# EAGLE design JasminUSBASP (EAGLE 7.1.0)
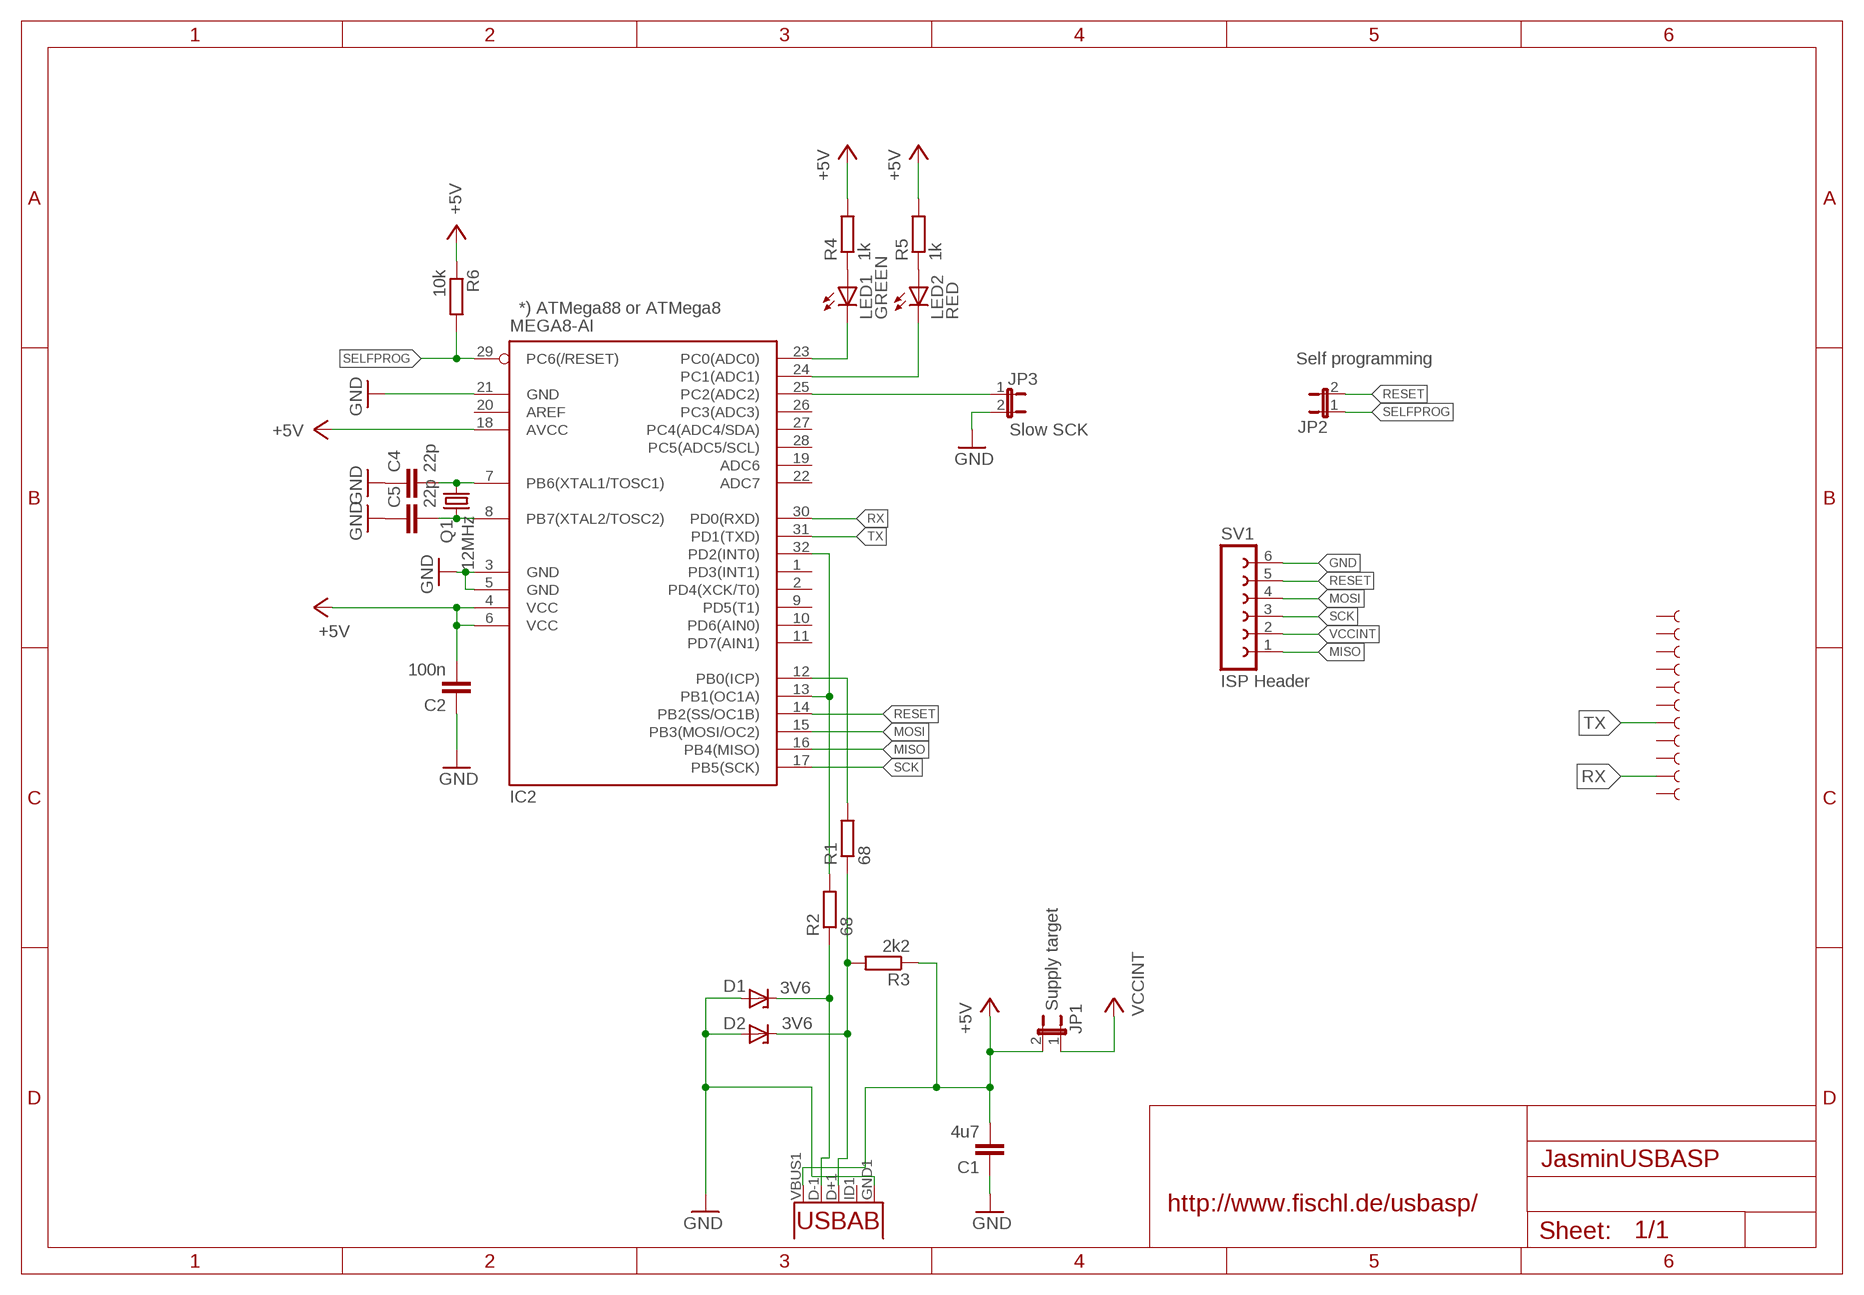
[diagram p0: schematic, sheet 1]

## Parts
A2/16  SEWTAP9  [PETAL-LONG-1-2SIDE]
A3/17  SEWTAP9  [PETAL-LONG-1-2SIDE]
A4/18  SEWTAP9  [PETAL-LONG-1-2SIDE]
A5/19  SEWTAP9  [PETAL-LONG-1-2SIDE]
C1  4u7  C-EUC1206  [C1206]
C2  100n  C-EUC1206  [C1206]
C4  22p  C-EUC1206  [C1206]
C5  22p  C-EUC1206  [C1206]
D1  3V6  ZENER-DIODEDO34-7  [DO34Z7]
D2  3V6  ZENER-DIODEDO34-7  [DO34Z7]
IC2  MEGA8-AI  [TQFP32-08]
JP1  Supply target  JP1E  [JP1]
JP2  Self programming  JP1E  [JP1]
JP3  Slow SCK  JP1E  [JP1]
JP9  Micro USB  USB-ABCONN-11794  [USB-AB-MICRO-SMD_V03]
LED1  GREEN  LEDCHIPLED_1206  [CHIPLED_1206]
LED2  RED  LEDCHIPLED_1206  [CHIPLED_1206]
Q1  12MHz  CRYTALHC49S  [HC49/S]
R1  68  R-EU_R1206  [R1206]
R2  68  R-EU_R1206  [R1206]
R3  2k2  R-EU_R1206  [R1206]
R4  1k  R-EU_R1206  [R1206]
R5  1k  R-EU_R1206  [R1206]
R6  10k  R-EU_R1206  [R1206]
SV1  ISP Header  FE06W  [FE06W]
U$4  SEWTAP9  [PETAL-LONG-1-2SIDE]
U$35  SEWTAP9  [PETAL-LONG-1-2SIDE]
U$37  SEWTAP9  [PETAL-LONG-1-2SIDE]
U$39  SEWTAP9  [PETAL-LONG-1-2SIDE]
U$41  SEWTAP9  [PETAL-LONG-1-2SIDE]
U$43  SEWTAP9  [PETAL-LONG-1-2SIDE]
U$45  SEWTAP9  [PETAL-LONG-1-2SIDE]

## Nets
+5V: C1.2 C2.2 IC2.4(VCC) IC2.6(VCC) IC2.18(AVCC) JP1.2 JP9.VBUS1(VBUS) R3.1 R4.2 R5.2 R6.1
GND: C1.1 C2.1 C4.1 C5.1 D1.A D2.A IC2.3(GND) IC2.5(GND) IC2.21(GND) JP3.2 JP9.GND1(GND) SV1.6
MISO: IC2.16(PB4(MISO)) SV1.1
MOSI: IC2.15(PB3(MOSI/OC2)) SV1.4
N$1: LED1.A R4.1
N$3: LED2.A R5.1
N$5: D2.C JP9.D+1(D+) R1.1 R3.2
N$7: IC2.13(PB1(OC1A)) IC2.32(PD2(INT0)) R2.2
N$8: D1.C JP9.D-1(D-) R2.1
N$12: IC2.25(PC2(ADC2)) JP3.1
N$14: IC2.23(PC0(ADC0)) LED1.C
N$15: IC2.24(PC1(ADC1)) LED2.C
N$16: IC2.12(PB0(ICP)) R1.2
N$22: C4.2 IC2.7(PB6(XTAL1/TOSC1)) Q1.2
N$23: C5.2 IC2.8(PB7(XTAL2/TOSC2)) Q1.1
RESET: IC2.14(PB2(SS/OC1B)) JP2.2 SV1.5
RX: IC2.30(PD0(RXD)) U$39.1
SCK: IC2.17(PB5(SCK)) SV1.3
SELFPROG: IC2.29(PC6(/RESET)) JP2.1 R6.2
TX: IC2.31(PD1(TXD)) U$41.1
VCCINT: JP1.1 SV1.2
Unconnected: A2/16.1 A3/17.1 A4/18.1 A5/19.1 IC2.1(PD3(INT1)) IC2.2(PD4(XCK/T0)) IC2.9(PD5(T1)) IC2.10(PD6(AIN0)) IC2.11(PD7(AIN1)) IC2.19(ADC6) IC2.20(AREF) IC2.22(ADC7) IC2.26(PC3(ADC3)) IC2.27(PC4(ADC4/SDA)) IC2.28(PC5(ADC5/SCL)) JP9.ID1(USBID) U$4.1 U$35.1 U$37.1 U$43.1 U$45.1

## Notes on the sheet
- *) ATMega88 or ATMega8
- http://www.fischl.de/usbasp/

## Library data of the parts
A2/16 A3/17 A4/18 A5/19 U$4 U$35 U$37 U$39 U$41 U$43 U$45 = LilyPad-Wearables:SEWTAP
C1 C2 C4 C5 = rcl:C-EU: CAPACITOR, European symbol
D1 D2 = diode:ZENER-DIODE: Z-Diode
IC2 = atmel:MEGA8: MICROCONTROLLER 8 Kbytes FLASH, 1 kbytes SRAM, 512 bytes EEPROM, USART, 6-channel 10 bit ADC, 2-channel 8 bit ADC Pin compatible with Atmega48, ATMega88, ATMega168 Source: avr.lbr; MPN: ATMEGA8-16AU; OC_FARNELL: 9171371; OC_NEWARK: 73M8863
JP1-JP3 = jumper:JP1E: JUMPER
JP9 = SparkFun-Connectors:USB-AB: This is a USB AB connector that is compatible with USB OTG. i.e. this connector can serve as a host or device; PROD_ID: CONN-11794
LED1 LED2 = led:LED: LED OSRAM: - CHIPLED LG R971, LG N971, LY N971, LG Q971, LY Q971, LO R971, LY R971 LH N974, LH R974 LS Q976, LO Q976, LY Q976 LO Q996 - Hyper CHIPLED LW Q18S LB Q993, LB Q99A, LB R99A - SideLED LS A670, LO A670, LY A670, LG A670, LP A670 LB A673, LV A673, LT A673, LW A673 LH A674 LY A675 LS A676, LA A676, LO A676, LY A676, LW A676 LS A679, LY A679, LG A679 - Hyper Micro SIDELED® LS Y876, LA Y876, LO Y876, LY Y876 LT Y87S - SmartLED LW L88C, LW L88S LB L89C, LB L89S, LG L890 LS L89K, LO L89K, LY L89K LS L896, LA L896, LO L896, LY L896 - TOPLED LS T670, LO T670, LY T670, LG T670, LP T670 LSG T670, LSP T670, LSY T670, LOP T670, LYG T670 LG T671, LOG T671, LSG T671 LB T673, LV T673, LT T673, LW T673 LH T674 LS T676, LA T676, LO T676, LY T676, LB T676, LH T676, LSB T676, LW T676 LB T67C, LV T67C, LT T67C, LS T67K, LO T67K, LY T67K, LW E67C LS E67B, LA E67B, LO E67B, LY E67B, LB E67C, LV E67C, LT E67C LW T67C LS T679, LY T679, LG T679 LS T770, LO T770, LY T770, LG T770, LP T770 LB T773, LV T773, LT T773, LW T773 LH T774 LS E675, LA E675, LY E675, LS T675 LS T776, LA T776, LO T776, LY T776, LB T776 LHGB T686 LT T68C, LB T68C - Hyper Mini TOPLED® LB M676 - Mini TOPLED Santana® LG M470 LS M47K, LO M47K, LY M47K Source: http://www.osram.convergy.de LUXEON: - LUMILED® LXK2-PW12-R00, LXK2-PW12-S00, LXK2-PW14-U00, LXK2-PW14-V00 LXK2-PM12-R00, LXK2-PM12-S00, LXK2-PM14-U00 LXK2-PE12-Q00, LXK2-PE12-R00, LXK2-PE12-S00, LXK2-PE14-T00, LXK2-PE14-U00 LXK2-PB12-K00, LXK2-PB12-L00, LXK2-PB12-M00, LXK2-PB14-N00, LXK2-PB14-P00, LXK2-PB14-Q00 LXK2-PR12-L00, LXK2-PR12-M00, LXK2-PR14-Q00, LXK2-PR14-R00 LXK2-PD12-Q00, LXK2-PD12-R00, LXK2-PD12-S00 LXK2-PH12-R00, LXK2-PH12-S00 LXK2-PL12-P00, LXK2-PL12-Q00, LXK2-PL12-R00 Source: www.luxeon.com KINGBRIGHT: KA-3528ASYC Source: www.kingbright.com
Q1 = crystal:CRYTAL: CRYSTAL
R1-R6 = rcl:R-EU_: RESISTOR, European symbol
SV1 = con-lsta:FE06W: FEMALE HEADER; OC_FARNELL: unknown; OC_NEWARK: unknown

## Net classes
1 VCC: width 0.254 mm

## Board
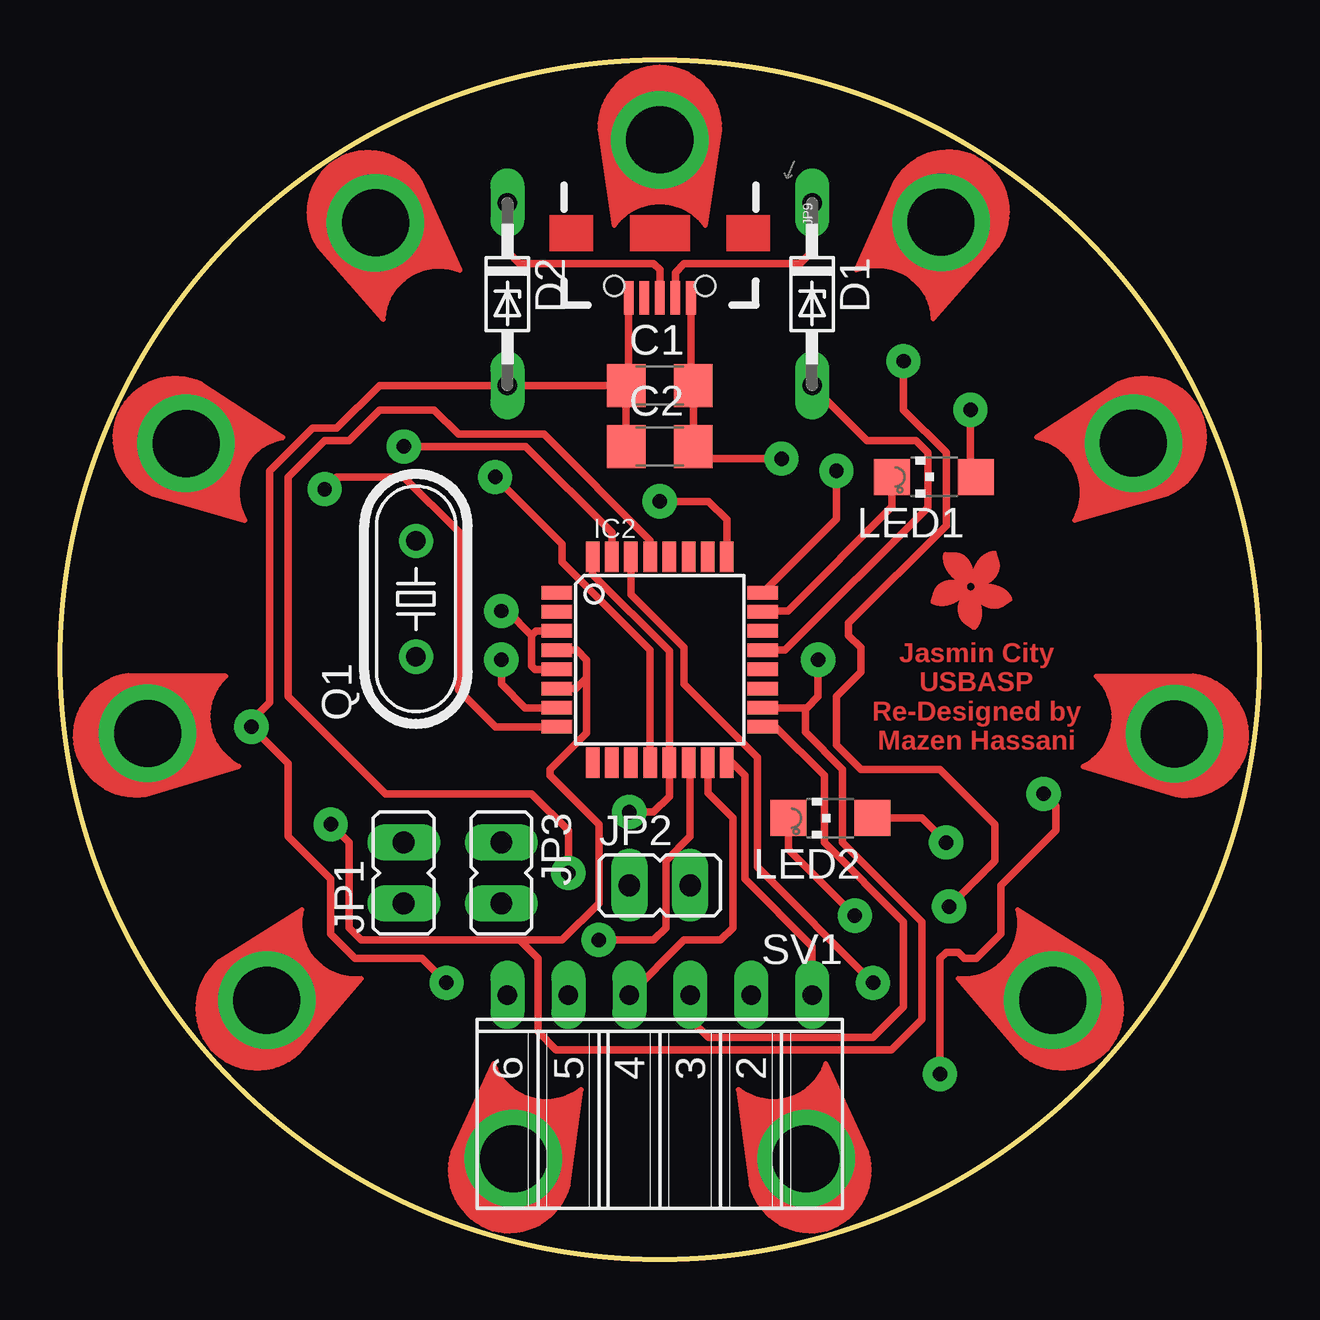
[diagram p1: board, top side]
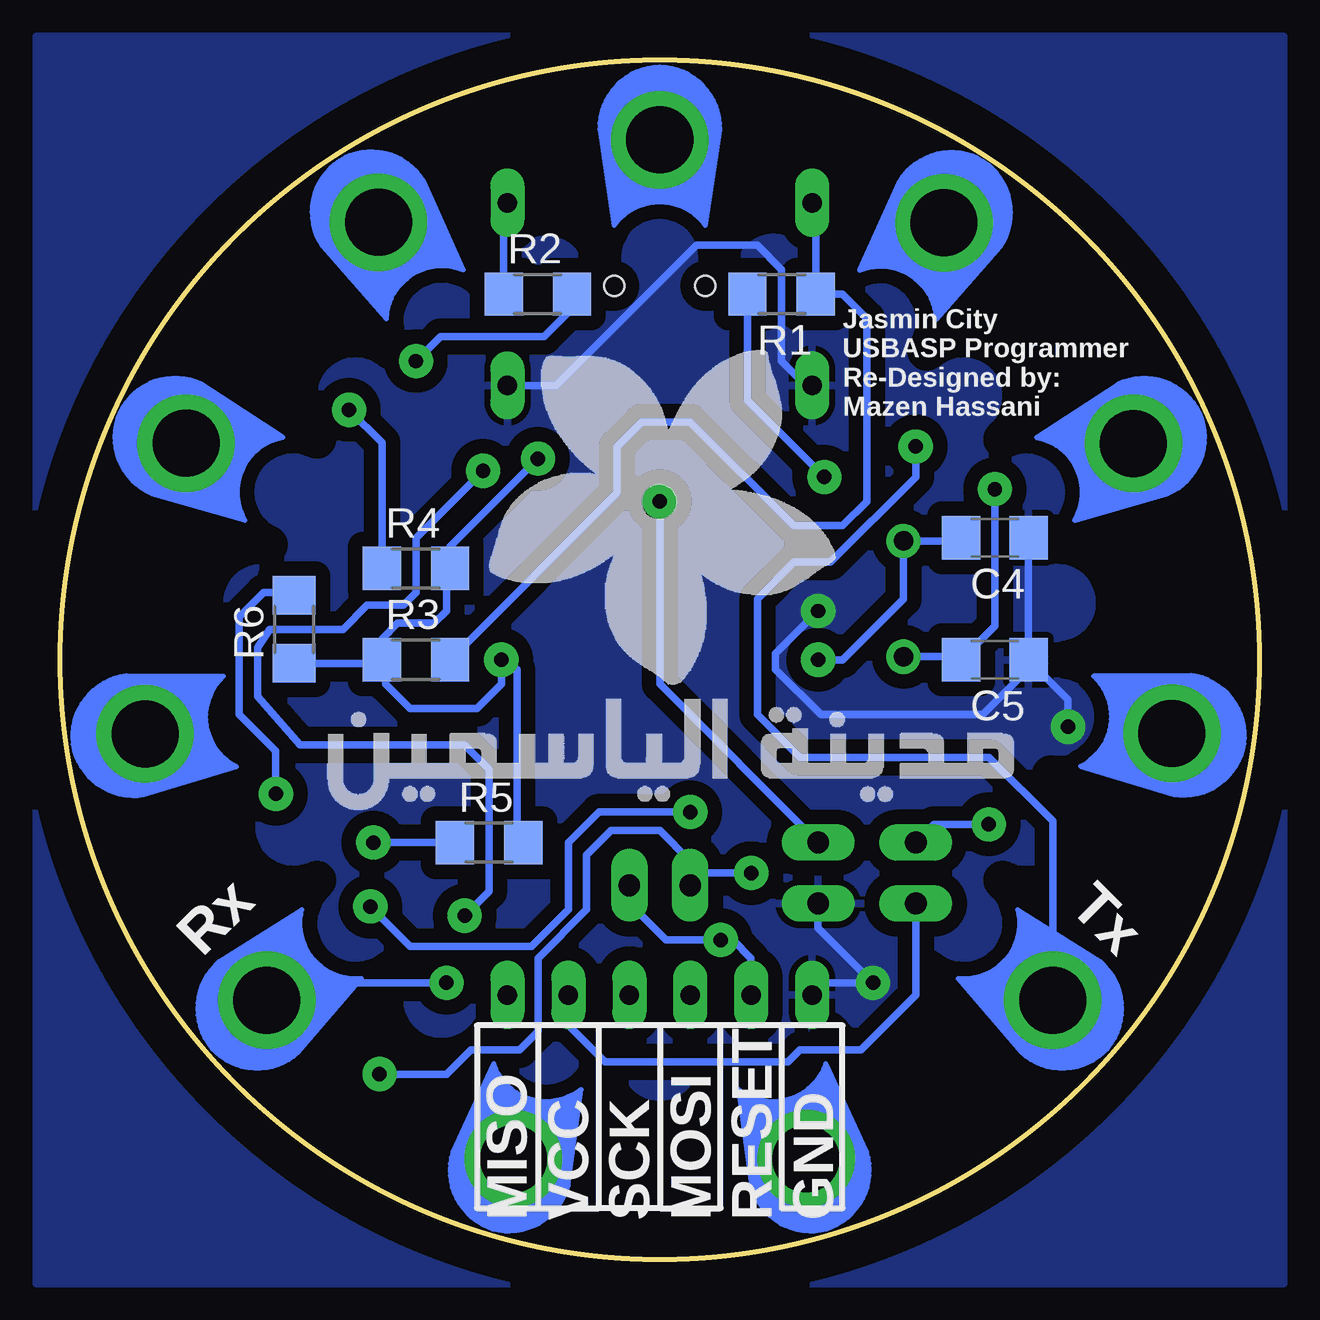
[diagram p2: board, bottom side, seen from below]

Size 50 x 50 mm. Coordinates in mm from the lower left corner, seen from the top.
Outline: circle at 25,25 radius 25
Copper layers (1*16): Top 0.035mm / dielectric 1.5mm / Bottom 0.035mm
Design rules "SparkFun": minimum track width 8mil, minimum drill 20mil, track to track 8mil, track to pad 8mil, pad to pad 8mil, via to via 8mil, smd to smd 8mil, copper to edge 8mil, drill to drill 8mil, minimum pad ring 12mil, minimum via ring 10mil, stop-mask expansion 4mil, vias tented up to drill 20mil, thermal gap 10mil
bRestrict: area 2.4,2.4 to 47.6,47.6; area 21,42.8 to 23.5,44; area 31.6,41.3 to 34.4,43; area 36.3,38.4 to 38.9,40.7; area 40,34.1 to 42,36.9; area 42.2,29.2 to 43.6,31.8; area 42.8,23.9 to 44,26.2; area 42.2,18.2 to 43.7,20.9; area 36.3,9.4 to 39,11.7; area 31.7,7 to 34.5,8.7; area 26.5,6 to 28.9,7.3; area 21.1,6 to 23.6,7.3; area 15.6,7 to 18.3,8.7; area 11,9.3 to 13.8,11.6; area 8,13.1 to 10.1,15.9; area 6.4,18.2 to 8,20.8; area 6,23.7 to 7.2,26.2; area 6.3,29.1 to 7.9,31.7; area 8,34 to 10.1,36.9; area 11,38.3 to 13.7,40.6; area 15.4,41.2 to 18.4,43; area 26.4,42.5 to 29.1,44; area 40,13 to 42,16.1; 22 lines

### Footprints (pad centres in the part's own frame; a part is rotated, then mirrored left to right if it is on the bottom)
PETAL-LONG-1-2SIDE = drill 2.794 pad 4.064: 1 0.03,0
C1206 = smd 1.6 x 1.8: 1 -1.4,0; 2 1.4,0
DO34Z7 = drill 0.813 long: A 3.81,0; C -3.81,0
TQFP32-08 = smd 1.27 x 0.559: 1 -4.293,2.8; 2 -4.293,2; 3 -4.293,1.2; 4 -4.293,0.4; 5 -4.293,-0.4; 6 -4.293,-1.2; 7 -4.293,-2; 8 -4.293,-2.8; 17 4.293,-2.8; 18 4.293,-2; 19 4.293,-1.2; 20 4.293,-0.4; 21 4.293,0.4; 22 4.293,1.2; 23 4.293,2; 24 4.293,2.8 | smd 0.559 x 1.27: 9 -2.8,-4.293; 10 -2,-4.293; 11 -1.2,-4.293; 12 -0.4,-4.293; 13 0.4,-4.293; 14 1.2,-4.293; 15 2,-4.293; 16 2.8,-4.293; 25 2.8,4.293; 26 2,4.293; 27 1.2,4.293; 28 0.4,4.293; 29 -0.4,4.293; 30 -1.2,4.293; 31 -2,4.293; 32 -2.8,4.293
JP1 = drill 0.914 long: 1 0,-1.27; 2 0,1.27
USB-AB-MICRO-SMD_V03 = smd 1.4 x 0.4: D+1 2.7,0; D-1 2.7,0.65; GND1 2.7,-1.3; ID1 2.7,-0.65; VBUS1 2.7,1.3 | hole 0.85: 2.2,1.9; 2.2,-1.9
CHIPLED_1206 = smd 1.5 x 1.5: A 0,-1.75; C 0,1.75
HC49/S = drill 0.813: 1 -2.413,0; 2 2.413,0
R1206 = smd 1.6 x 1.803: 1 -1.422,0; 2 1.422,0
FE06W = drill 0.813 long: 1 -6.35,0; 2 -3.81,0; 3 -1.27,0; 4 1.27,0; 5 3.81,0; 6 6.35,0

### Placement (x,y rotation side)
A2/16  44.77,34.04 204.5 top
A3/17  36.74,43.26 237.3 top
A4/18  25,46.7 270 top
A5/19  13.13,43.24 302.7 top
C1  25,36.43 0 top
C2  25,33.89 0 top
C4  11.03,30.08 180 bottom
C5  11.03,25 180 bottom
D1  31.35,40.24 270 top
D2  18.65,40.24 270 top
IC2  25,25 0 top
JP1  14.33,16.11 0 top
JP2  25,15.6 270 top
JP3  18.4,16.11 180 top
JP9  25,42.78 270 top
LED1  36.43,32.62 90 top
LED2  32.11,18.4 90 top
Q1  14.84,27.54 90 top
R1  19.92,40.24 180 bottom
R2  30.08,40.24 0 bottom
R3  35.16,25 0 bottom
R4  35.16,28.81 0 bottom
R5  32.11,17.38 0 bottom
R6  40.24,26.27 90 bottom
SV1  25,11.03 180 top
U$1  [JASMIN_CITY]  38.97,18.65 0 bottom
U$2  [JASMIN_1/4]  37.95,28.05 0 top
U$4  46.48,21.91 171.8 top
U$35  18.89,4.17 73.7 top
U$37  31.11,4.17 106.3 top
U$39  41.4,10.79 139.1 top
U$41  8.6,10.79 40.9 top
U$43  5.23,34.03 335.5 top
U$45  3.62,21.92 8.2 top

### Tracks (layer width: path | path; a pad name or v marks a point on that pad's centre or on a via)
+5V  (via drill 0.6 pad 1.42)
  Top 0.305: JP9.VBUS1 26.3,36.53 C1.2 C2.2 26.91,33.38 v30.08,33.38 | IC2.4 21.55,25.4 21.95,25 21.95,24.24 | IC2.6 21.51,23.8 21.95,24.24 | v31.6,25 31.6,23.48 31.13,23 31.06,23 | 21.95,24.24 21.95,21.95 20.43,20.43 20.43,20.17 22.46,18.14 22.46,14.84 20.94,13.32 19.16,13.32 | 19.16,13.32 12.55,13.32 12.05,13.82 12.05,17.38 v11.28,18.14 | IC2.18 31.06,23 | 19.16,13.32 19.92,12.55 19.92,9.51 20.68,8.74 34.65,8.74 35.92,10.01 35.92,14.08 32.62,17.38 32.62,20.43 31.06,21.98 31.06,23
  Bottom 0.305: R6.1 36.73,24.85 R3.1 | R3.1 36.43,24.85 36.43,23.98 35.41,22.97 32.62,22.97 31.6,23.98 v31.6,25 30.94,24.59 30.94,17.63 R5.2 | v30.08,33.38 33.74,29.72 R4.2 33.89,28.66 33.89,27.03 34.4,26.52 35.92,26.52 36.58,25.86 R3.1 | JP1.2 13.57,18.14 v11.28,18.14
GND  (via drill 0.6 pad 1.42)
  Top 0.305: IC2.3 19.85,26.2 19.67,26.02 | 19.67,26.02 19.67,24.75 19.81,24.6 IC2.5 | C2.1 C1.1 | JP9.GND1 23.7,36.53 C1.1 | C1.1 D2.A 13.32,36.43 11.54,34.65 10.52,34.65 8.74,32.87 8.74,23.22 7.98,22.46 v7.98,22.21 9.51,20.68 9.51,17.63 11.28,15.86 11.28,13.57 12.3,12.55 15.09,12.55 v16.11,11.54 | v18.4,27.03 18.65,27.03 19.67,26.02 | IC2.21 30.23,25.4 36.18,31.35 36.18,33.64 35.67,34.14 33.64,34.14 D1.A
  Bottom 0.305: JP3.2 18.4,13.82 v16.11,11.54 18.14,11.54 SV1.6 | v7.98,22.21 7.98,23.35 C5.1 | D1.A 29.32,36.43 23.48,42.27 20.94,42.27 19.92,41.26 19.92,37.45 18.9,36.43 D2.A | C4.1 C5.1 | C5.1 9.63,24.62 11.54,22.71 18.29,22.71 20.17,24.6 20.17,25.25 v18.4,27.03
  pour Bottom (isolate 0.61): -1,51 51,51 51,-1 -1,-1
MISO
  Top 0.305: SV1.1 31.35,13.06 28.56,15.86 28.56,20.17 28.03,20.7 IC2.16
MOSI
  Top 0.305: SV1.4 26.02,13.32 27.54,13.32 28.05,13.82 28.05,18.4 27,19.44 IC2.15
N$1  (via drill 0.6 pad 1.42)
  Top 0.305: LED1.A 37.95,32.85 v37.95,35.41
  Bottom 0.305: R4.1 36.58,34.04 v37.95,35.41
N$3  (via drill 0.6 pad 1.42)
  Top 0.305: LED2.A 35.92,18.4 v36.94,17.38
  Bottom 0.305: v36.94,17.38 R5.1
N$5
  Top 0.305: JP9.D+1 25,41.26 24.75,41.51 19.16,41.51 18.65,42.02 D2.C
  Bottom 0.305: D2.C 18.5,43.9 R1.1 17.38,40.24 16.36,39.22 16.36,31.6 17.38,30.59 19.41,30.59 23.73,34.91 25.76,34.91 26.78,33.89 26.78,31.96 R3.2 33.74,25.41
N$7  (via drill 0.6 pad 1.42)
  Top 0.305: IC2.32 22.21,28.56 25.4,25.36 IC2.13 25.4,19.3 24.75,18.65 v23.73,18.65 | v37.06,14.71 38.97,16.62 38.97,18.14 36.68,20.43 33.38,20.43 32.37,21.44 32.37,23.48 33.38,24.49 33.38,25.51 32.87,26.02 32.87,26.52 36.94,30.59 36.94,33.64 35.16,35.41 v35.16,37.45
  Bottom 0.305: R2.2 28.66,39.63 29.83,38.46 34.14,38.46 v35.16,37.45 | v37.06,14.71 35.41,13.06 30.33,13.06 28.81,14.59 28.81,17.38 27.54,18.65 v23.73,18.65
N$8
  Top 0.305: JP9.D-1 25.65,41.14 26.02,41.51 30.84,41.51 31.35,42.02 D1.C
  Bottom 0.305: R2.1 31.5,43.9 D1.C
N$12  (via drill 0.6 pad 1.42)
  Top 0.305: IC2.25 27.8,30.84 27.03,31.6 v25,31.6
  Bottom 0.305: v25,31.6 25,23.98 JP3.1
N$14
  Top 0.305: LED1.C 34.68,31.38 30.33,27.03 29.32,27.03 IC2.23
N$15  (via drill 0.6 pad 1.42)
  Top 0.305: LED2.C 30.36,17.1 v33.13,14.33 | IC2.24 32.37,30.87 v32.37,32.87
  Bottom 0.305: v33.13,14.33 32.11,15.35 32.11,20.43 33.13,21.44 39.99,21.44 41.76,23.48 41.76,25.51 41.26,26.27 38.21,26.27 37.19,27.29 35.67,27.29 35.16,27.79 35.16,30.08 v32.37,32.87
N$16  (via drill 0.6 pad 1.42)
  Top 0.305: IC2.12 24.6,25.4 20.94,29.06 20.94,29.83 v18.14,32.62
  Bottom 0.305: R1.2 21.34,35.82 v18.14,32.62
N$22  (via drill 0.6 pad 1.42)
  Top 0.305: IC2.7 19.38,23 18.4,23.98 v18.4,25
  Bottom 0.305: C4.2 12.43,29.95 Q1.2 14.84,27.54 17.38,25 v18.4,25
N$23  (via drill 0.6 pad 1.42)
  Top 0.305: IC2.8 18.15,22.2 16.62,23.73 16.62,30.33 14.33,32.62 11.54,32.62 v11.03,32.11
  Bottom 0.305: Q1.1 12.43,25.13 C5.2 11.03,26.4 v11.03,32.11
RESET  (via drill 0.6 pad 1.42)
  Top 0.305: IC2.14 26.27,20.64 26.27,17.63 25.25,16.62 25.25,13.82 24.75,13.32 v22.46,13.32
  Bottom 0.305: SV1.5 21.19,12.55 21.95,13.32 v22.46,13.32 24.75,13.32 26.27,14.84 JP2.2
RX  (via drill 0.6 pad 1.42)
  Top 0.305: IC2.30 23.8,27.72 26.02,25.51 26.02,23.98 29.06,20.94 29.06,16.36 v33.89,11.54
  Bottom 0.305: v33.89,11.54 40.65,11.54 U$39.1
SCK
  Top 0.305: SV1.3 26.27,10.01 27.03,9.25 33.89,9.25 35.16,10.52 35.16,14.08 31.86,17.38 31.86,20.17 29.83,22.2 IC2.17
SELFPROG  (via drill 0.6 pad 1.42)
  Top 0.305: IC2.29 24.6,29.97 20.17,34.4 16.62,34.4 15.6,35.41 13.32,35.41 12.05,34.14 11.03,34.14 9.51,32.62 9.51,23.48 13.57,19.41 19.67,19.41 21.19,17.89 v21.19,16.11 | v36.68,7.73 36.68,12.55 36.94,12.81 37.45,12.81 37.7,12.55 38.21,12.55 39.22,13.57 39.22,15.6 41.51,17.89 41.51,18.9 v41,19.41
  Bottom 0.305: 40.6,27.69 R6.2 40.34,27.79 41.51,27.79 42.53,26.78 42.53,22.71 41,21.19 v41,19.41 | 23.73,16.11 v21.19,16.11 | JP2.1 23.73,16.11 | 23.73,16.11 23.73,16.62 25,17.89 27.03,17.89 28.05,16.87 28.05,14.59 30.08,12.55 30.08,9.51 30.84,8.74 32.87,8.74 33.89,7.73 v36.68,7.73
TX  (via drill 0.6 pad 1.42)
  Top 0.305: IC2.31 23,30.3 19.41,33.89 v14.33,33.89
  Bottom 0.305: U$41.1 8.62,18.27 11.28,20.94 19.16,20.94 20.94,22.71 20.94,27.54 19.41,29.06 17.89,29.06 14.33,32.62 v14.33,33.89
VCCINT
  Bottom 0.305: SV1.2 28.81,9.76 27.29,8.24 19.67,8.24 19.16,8.74 16.62,8.74 14.33,11.03 JP1.1

### Text on the board
Top: Jasmin City / USBASP / Re-Designed by / Mazen Hassani
Dimension: السلام عليكم ^_^ / / العدد : 30 قطعة / اللون : أسود / البادات على الوجهين / سيلك سكريين على الوجه الخلفي فقط / / كل الشكر :))
bPlace: Jasmin City / USBASP Programmer / Re-Designed by: / Mazen Hassani | Tx | Rx | MISO / VCC / SCK / MOSI / RESET / GND